# EAGLE design AK-NW-40 (EAGLE 9.6.2)
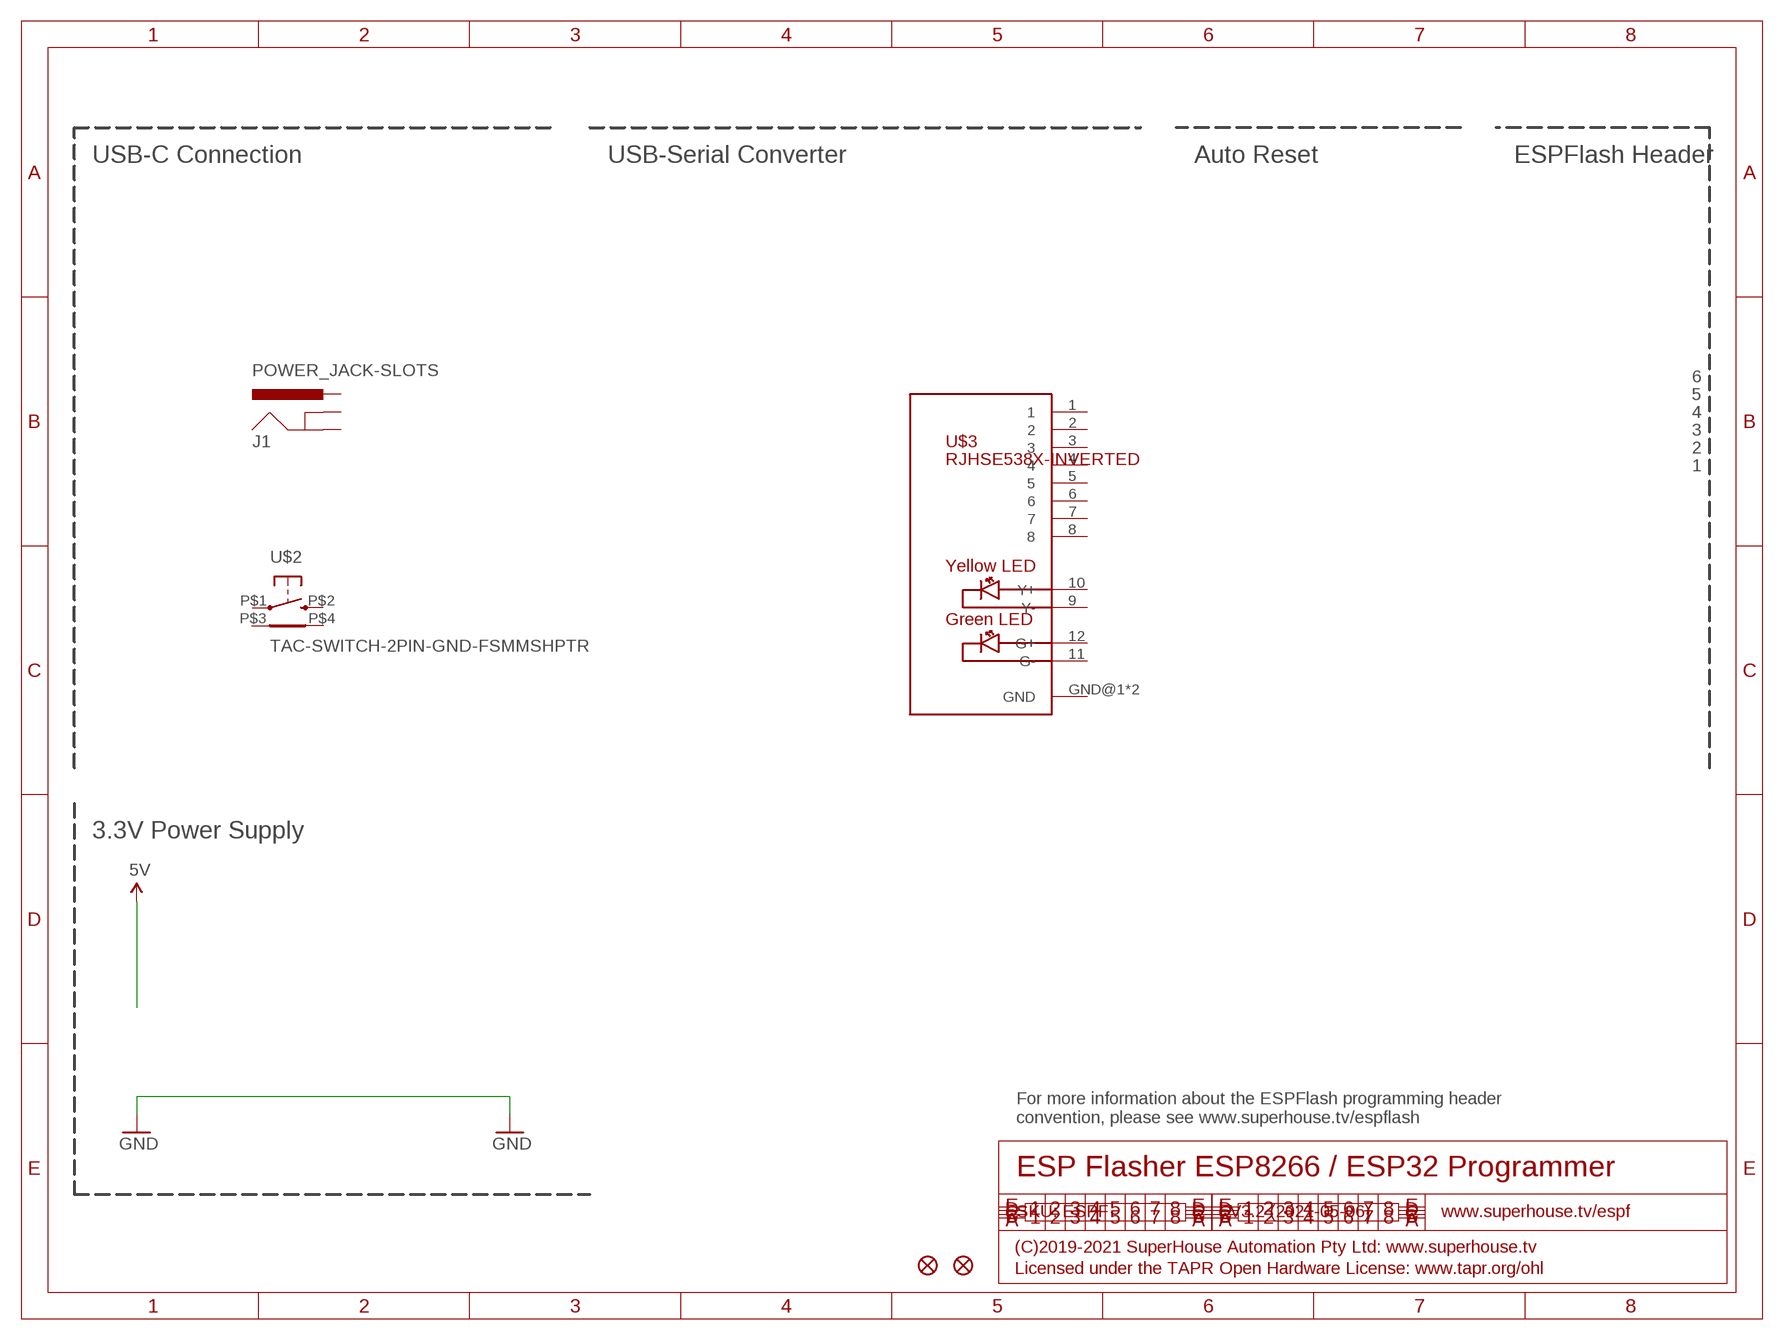
[diagram p0: schematic, sheet 1]

## Parts
FID1  FIDUCIAL1X2.5  [FIDUCIAL-1X2.5]
FID2  FIDUCIAL1X2.5  [FIDUCIAL-1X2.5]
J1  POWER_JACK-SLOTS  [POWER_JACK_SLOTS]
U$2  TAC-SWITCH-2PIN-GND-FSMMSHPTR  [TC-120V]
U$3  RJHSE538X-INVERTED  [RJHSE538X]
Unconnected: J1.GND J1.GNDBREAK J1.PWR U$2.P$1 U$2.P$2 U$2.P$3(TAB1) U$2.P$4(TAB2) U$3.1 U$3.2 U$3.3 U$3.4 U$3.5 U$3.6 U$3.7 U$3.8 U$3.9(Y-) U$3.10(Y+) U$3.11(G-) U$3.12(G+) U$3.GND@1(GND) U$3.GND@2(GND)

## Notes on the sheet
- USB-C Connection | USB-Serial Converter | Auto Reset | ESPFlash Header
- 6
- 5
- 4
- 3
- 2
- 1
- 3.3V Power Supply
- For more information about the ESPFlash programming header
  convention, please see www.superhouse.tv/espflash
- ESP Flasher ESP8266 / ESP32 Programmer
- SKU: ESPF | V3.2 (2021-05-06) | www.superhouse.tv/espf
- (C)2019-2021 SuperHouse Automation Pty Ltd: www.superhouse.tv
- Licensed under the TAPR Open Hardware License: www.tapr.org/ohl

## Library data of the parts
FID1 FID2 = SuperHouse-Symbols:FIDUCIAL: Fiducial Alignment Points Various fiducial points for machine vision alignment.
J1 = SuperHouse-Connectors:POWER_JACK: Power Jack This is the standard 5.5mm barrel jack for power. The PTH is the most common, proven, reliable, footprint. All others are experimental. The Slot footprint only works if the mill layer is transmitted to the PCB fab house so be warned. Spark Fun Electronics SKU : PRT-00119. Mating wall wart : TOL-00298 (and others)
U$2 = SuperHouse-Switches:TAC-SWITCH-2PIN-GND: Tactile switch (right angle) with 2 mounting tabs
U$3 = SuperHouse-Connectors:RJHSE538X: 8P8C RJ45 socket with LEDs Amphenol RJHSE538X

## Net classes
0 default: width 0.152 mm, drill 0.241 mm, clearance 0.152 mm

## Board
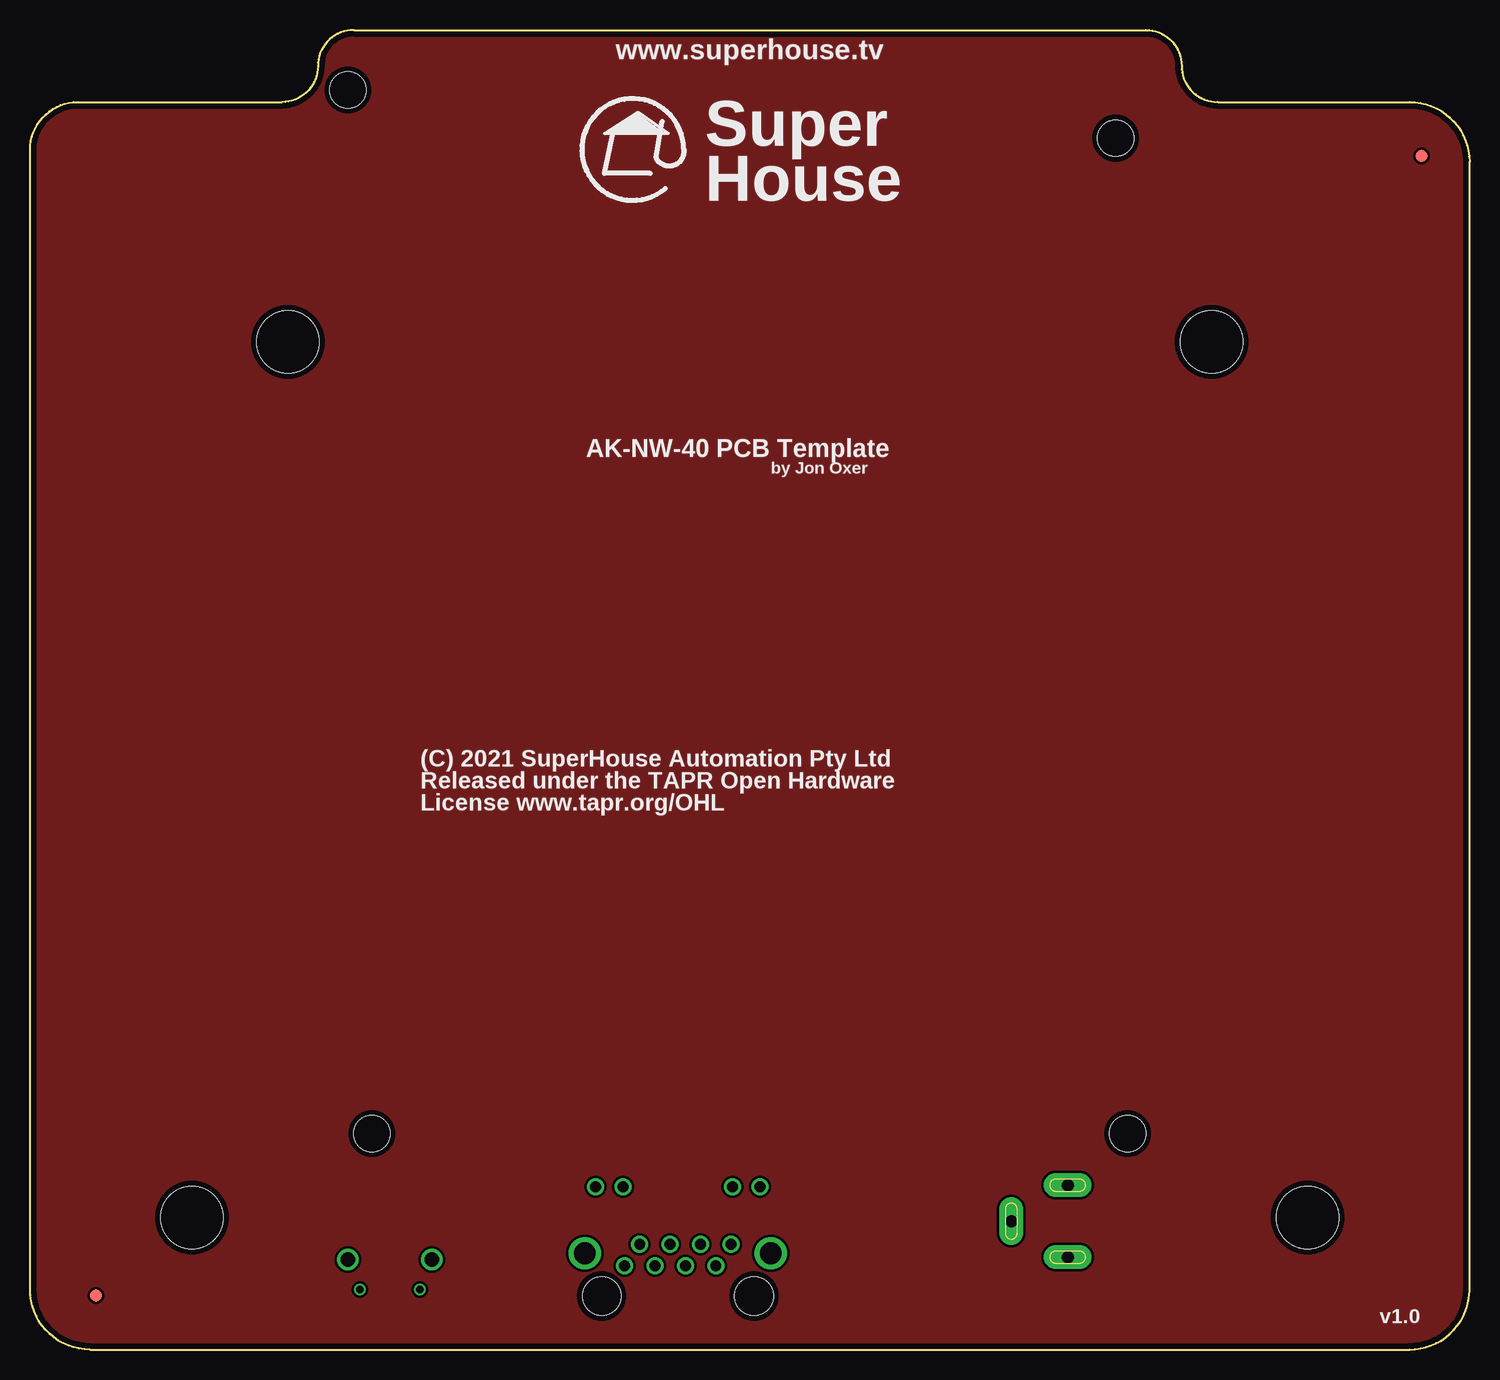
[diagram p1: board, top side]
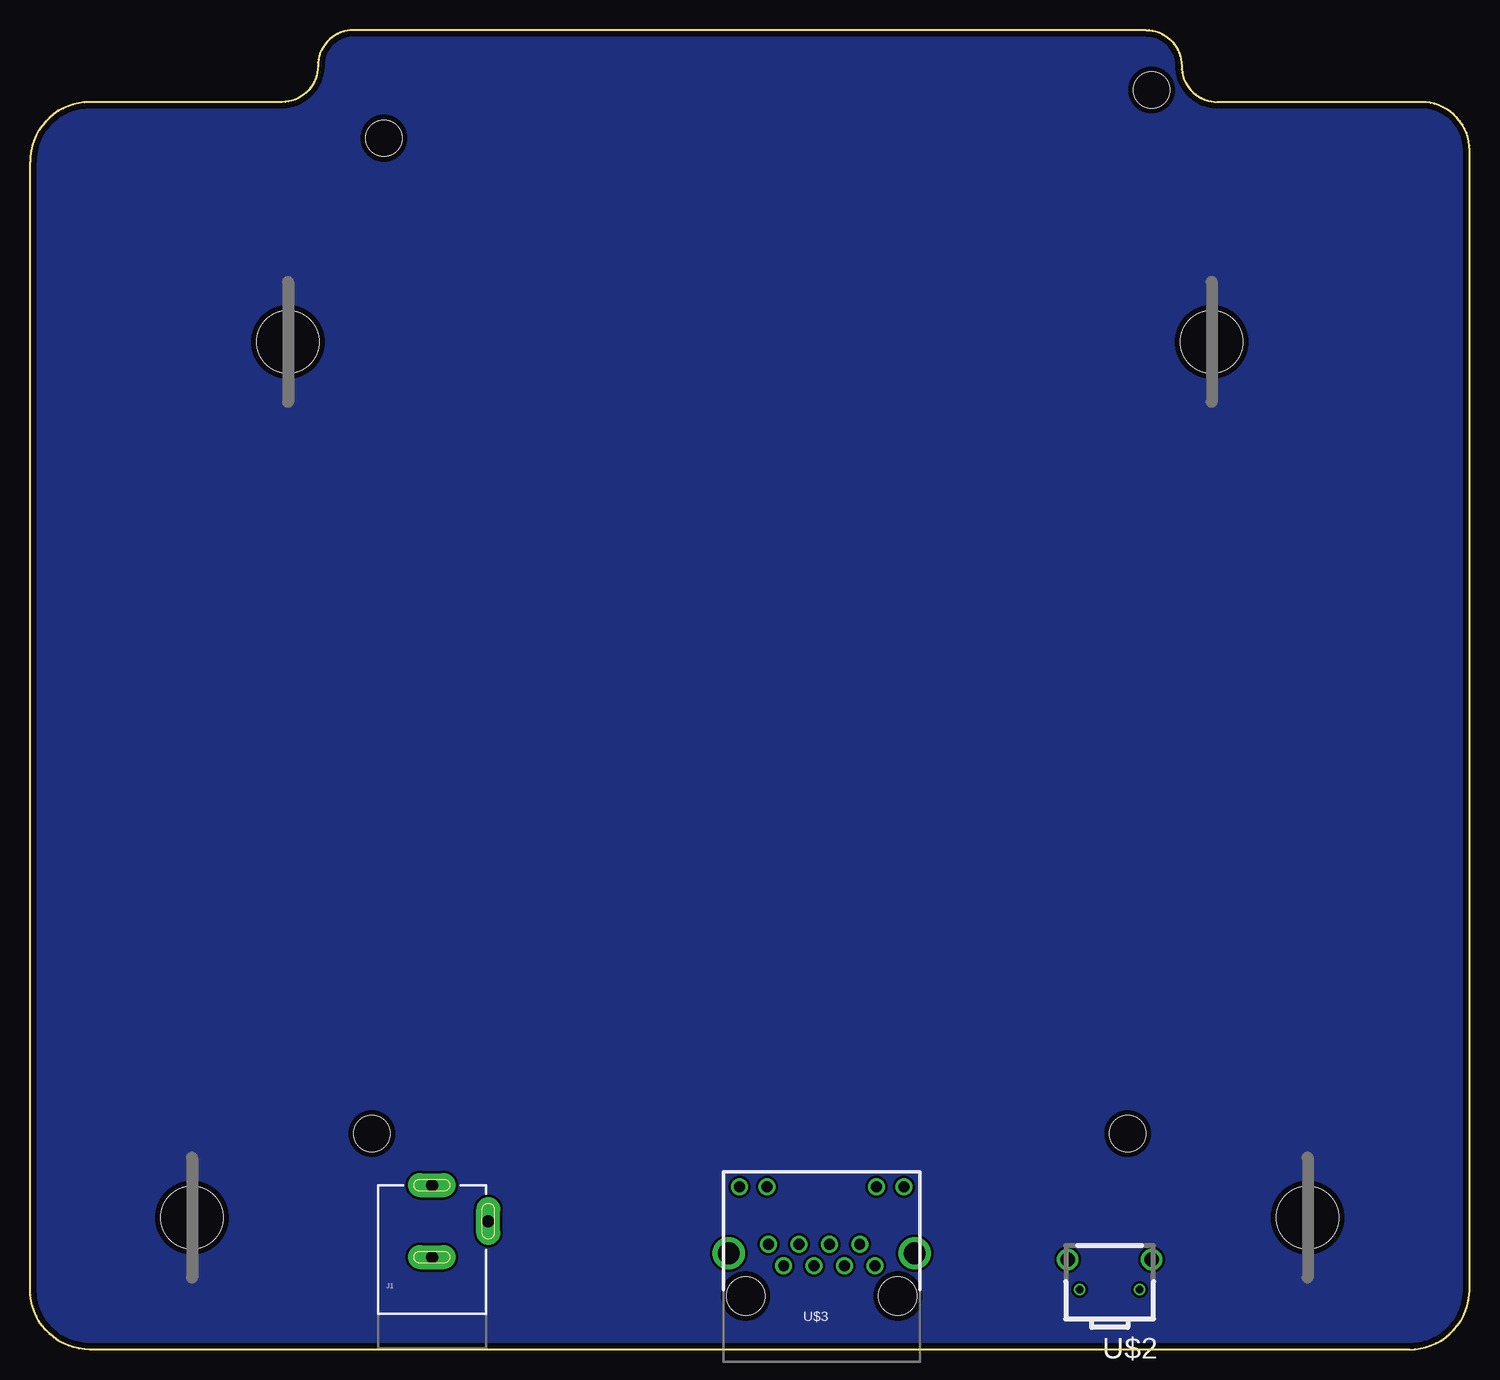
[diagram p2: board, bottom side, seen from below]

Size 120 x 110 mm. Coordinates in mm from the lower left corner, seen from the top.
Outline: 5,0 115,0 arc90 120,5 120,99 arc90 115,104 99,104 arc-90 96,107 arc90 93,110 27,110 arc90 24,107 arc-90 21,104 4,104 arc90 0,100 0,5 arc90 5,0
Copper layers (1*16): Top 0.035mm / dielectric 1.5mm / Bottom 0.035mm
Design rules "SuperHouse-Design-Rules": minimum track width 10mil, minimum drill 24mil, track to track 8mil, track to pad 8mil, pad to pad 8mil, via to via 8mil, smd to smd 6mil, copper to edge 18mil, drill to drill 8mil, minimum pad ring 7mil, minimum via ring 8mil, stop-mask expansion 4mil, vias tented up to drill 0.5mm, thermal gap 10mil
Holes 5.2 mm at 106.5,11 13.5,11 21.5,84 98.5,84
Holes 3 mm at 28.5,18 91.5,18 26.5,105 90.5,100.99

### Footprints (pad centres in the part's own frame; a part is rotated, then mirrored left to right if it is on the bottom)
FIDUCIAL-1X2.5 = smd 1 x 1: 1 0,0
POWER_JACK_SLOTS = drill 1 pad 2 long: GND 0,7.7; GNDBREAK 4.7,10.7; PWR 0,13.7
TC-120V = drill 0.6: P$1 -2.5,0; P$2 2.5,0 | drill 1.2: P$3 -3.5,-2.5; P$4 3.5,-2.5
RJHSE538X = drill 0.9 pad 1.422: 1 4.445,7.99; 2 3.175,9.77; 3 1.905,7.99; 4 0.635,9.77; 5 -0.635,7.99; 6 -1.905,9.77; 7 -3.175,7.99; 8 -4.445,9.77; 9 6.86,14.57; 10 4.57,14.57; 11 -4.57,14.57; 12 -6.86,14.57 | drill 1.8: GND@1 -7.75,9.02; GND@2 7.75,9.02 | hole 3.2: -6.35,5.45; 6.35,5.45

### Placement (x,y rotation side)
FID1  5.5,4.5 0 top
FID2  116,99.5 0 top
J1  86.5,0 0 bottom
U$2  30,5 180 bottom
U$3  54,-1 0 bottom

### Tracks (layer width: path | path; a pad name or v marks a point on that pad's centre or on a via)
GND
  pour Top: 5,0 115,0 arc90 120,5 120,99 arc90 115,104 99,104 arc-90 96,107 arc90 93,110 27,110 arc90 24,107 arc-90 21,104 4,104 arc90 0,100 0,5 arc90
  pour Bottom: 27,110 arc90 24,107 arc-90 21,104 18,104 5,104 4,104 arc90 0,100 0,97 0,5 arc90 5,0 9,0 73,0 115,0 arc90 120,5 120,7 120,80 120,99 arc90 115,104 112,104 99,104 arc-90 96,107 arc90 93,110 88,110

### Text on the board
tPlace: www.superhouse.tv | Super / House | AK-NW-40 PCB Template | by Jon Oxer | (C) 2021 SuperHouse Automation Pty Ltd / Released under the TAPR Open Hardware / License www.tapr.org/OHL | v1.0
tValues: K | A | K | A | K | A